# EasyEDA Pro project rf_connector_pcb.eprj

# Schematic Schematic1
Board Name: Board1; Create Date: 2024-05-29; Page Name: P1; Project Name: rf_connector_pcb; Schematic Name: Schematic1; Update Date: 2024-05-29; Company: EasyEDA.com; Drawn: EasyEDA; Page Size: A4; Part Number: JLCPCB-002; Reviewed: EasyEDA; Version: V0.1
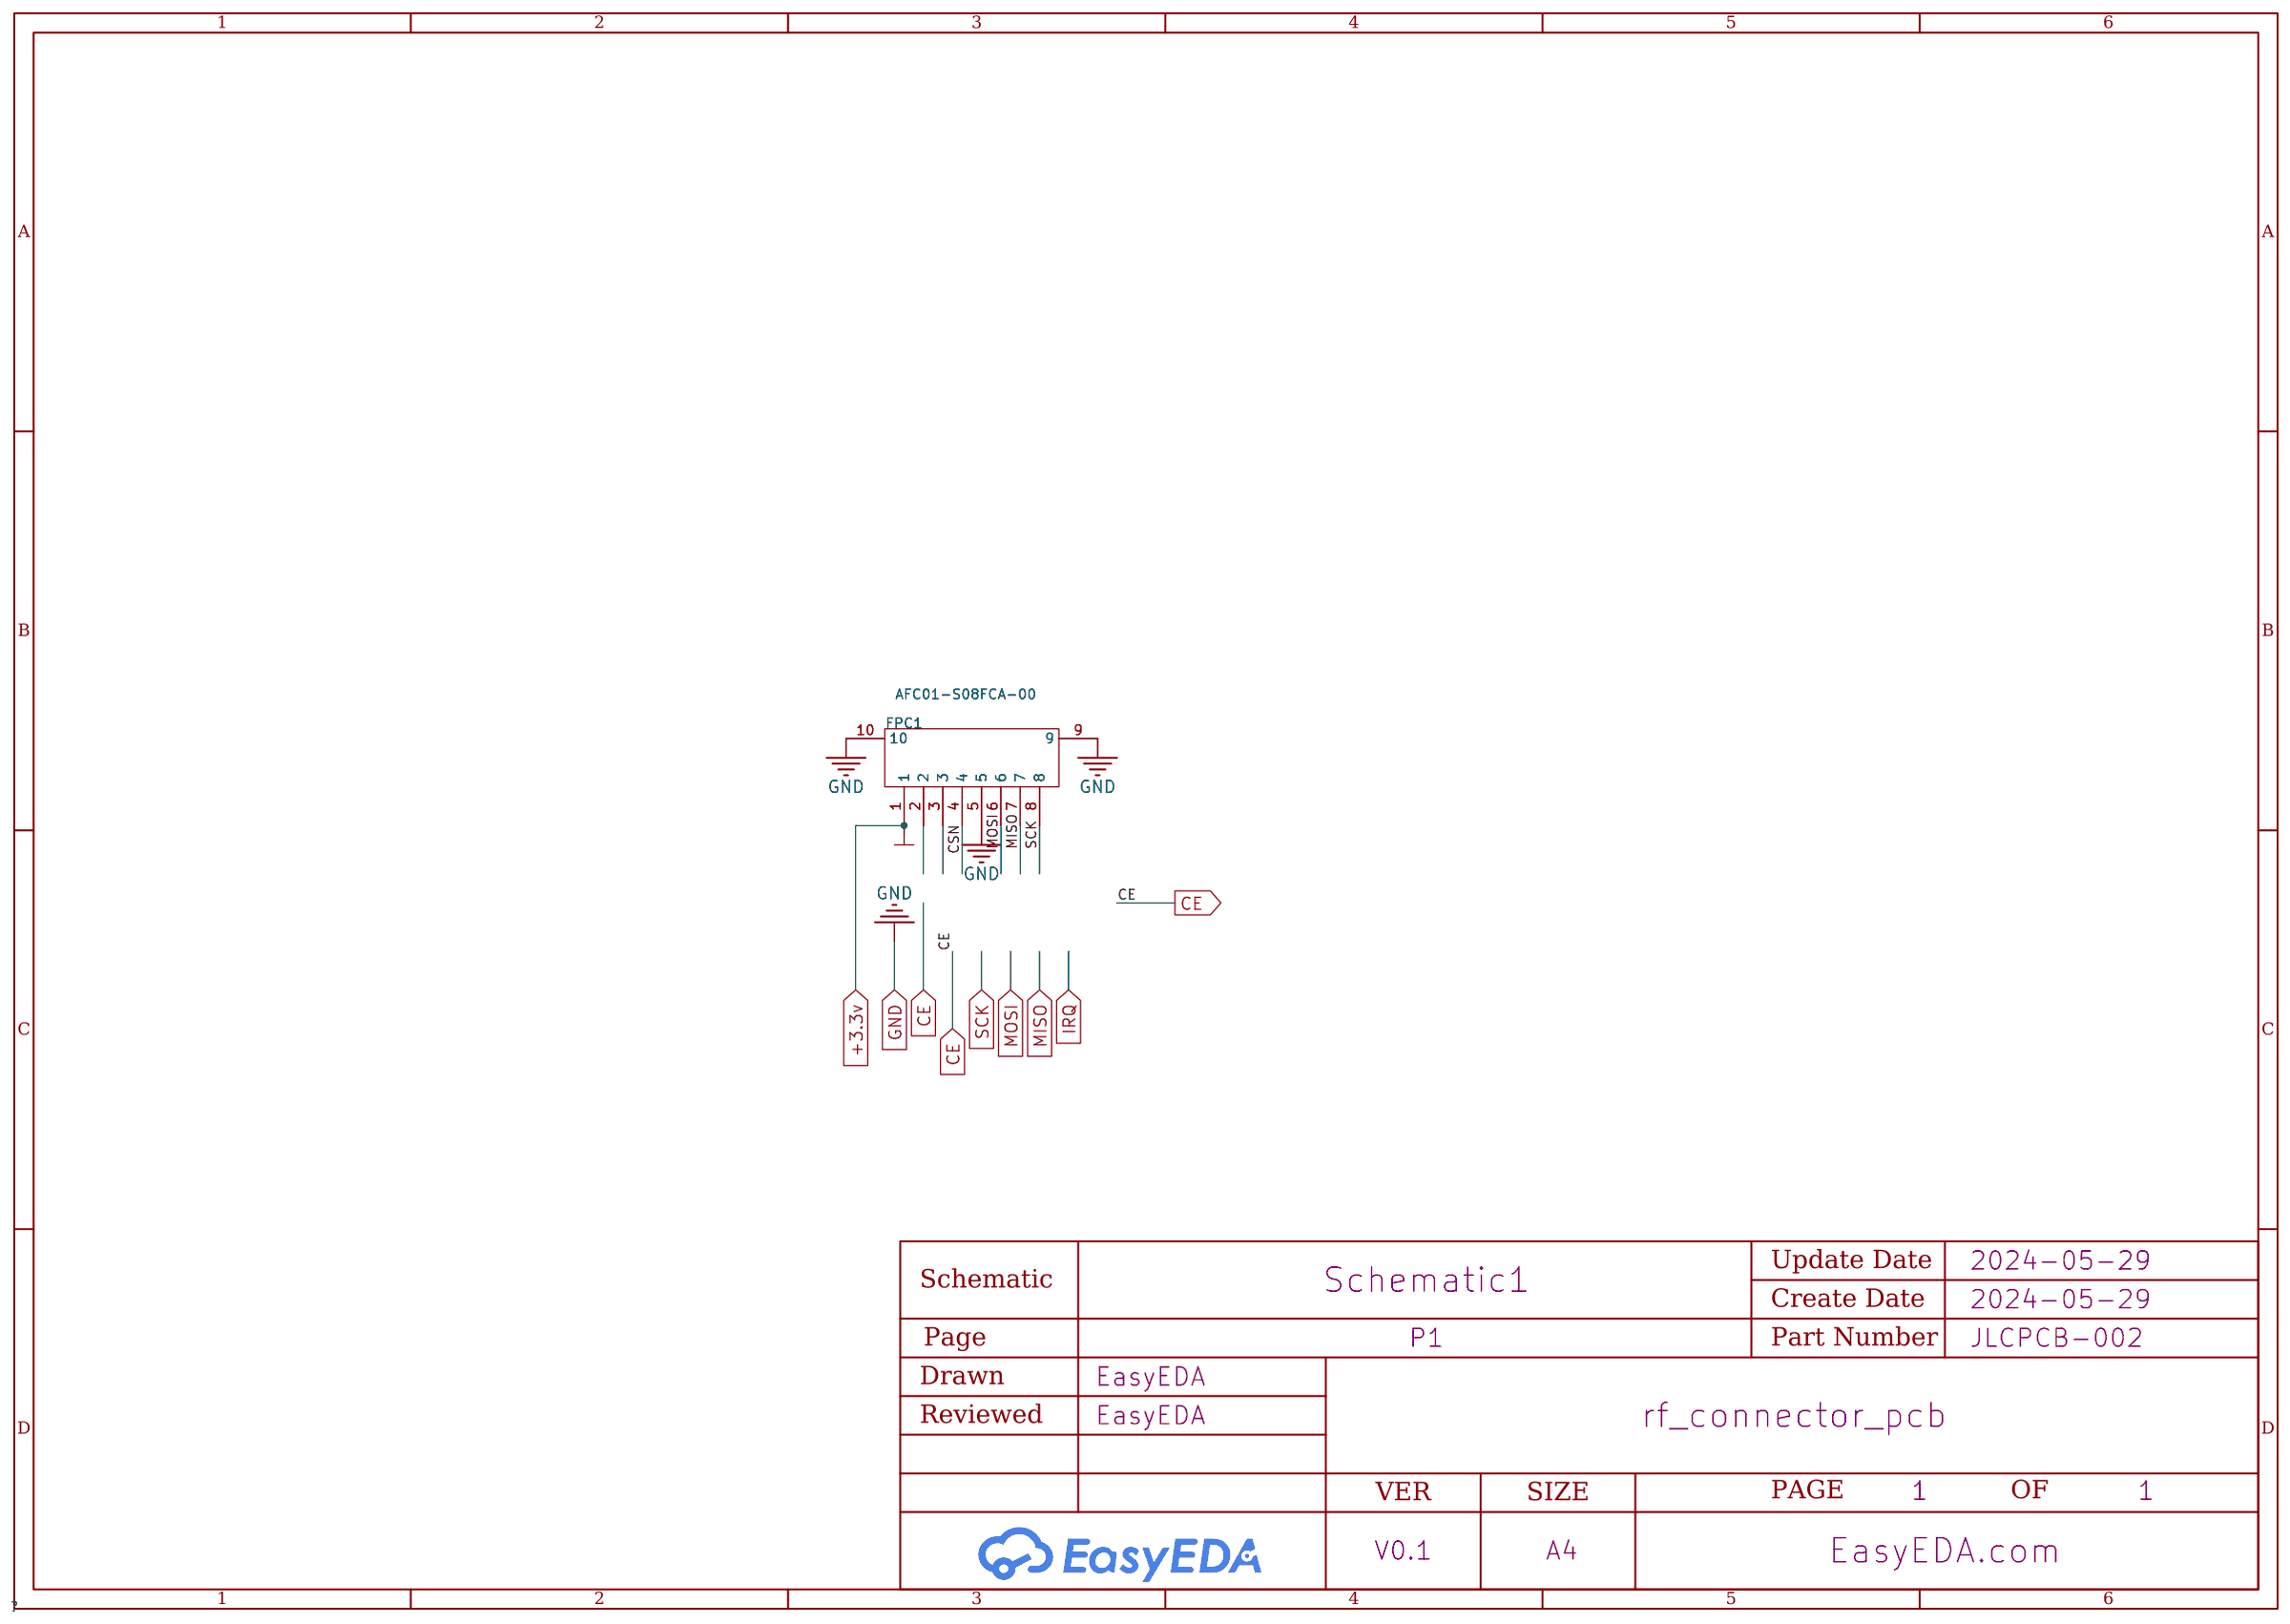
[diagram p0: schematic sheet]

## Parts
FPC1  AFC01-S08FCA-00  [FPC-SMD_P0.50-8P_FGS-XJ-H2.0]

## Library data of the parts
FPC1 = AFC01-S08FCA-00: 间距:0.5mm;触点数量:8P;锁定特性:翻盖式;触点类型:下接;安装类型:卧贴;; LCSC Part Name: 间距:0.5mm P数:8P 翻盖式 下接; Supplier Part: C262657; Manufacturer: JS(钜硕电子); Supplier Footprint: SMD,P=0.5mm; JLCPCB Part Class: 扩展库; Datasheet: https://atta.szlcsc.com/upload/public/pdf/source/20190816/C413942_2A72D1AC756EAE17EEDF756A339D4500.pdf; Supplier: LCSC; Pitch: 0.5mm; Number of Contacts: 8P; Locking Feature: 翻盖式; FFC, FCB Thickness: 0.3mm; Contact Type: 下接; Mounting Type: 卧贴; Height Above Board: 2mm

## Nets
+3.3v: FPC1.1
GND: FPC1.5 FPC1.9 FPC1.10
CSN: FPC1.4
MISO: FPC1.7
MOSI: FPC1.6
SCK: FPC1.8

Not connected (* = marked no-connect by the designer): FPC1 2 3

# Board PCB1
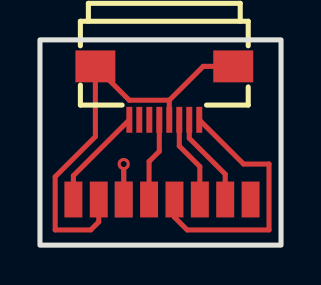
[diagram p1: board, top side]
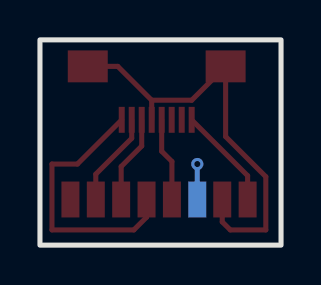
[diagram p2: board, bottom side, seen from below]

Outline 12.06 x 10.29 mm; copper layers: Top Layer, Bottom Layer. Coordinates in mm from the lower left corner of the outline.
Outline path: rectangle 0,10.29 12.06,0
Stack: Top Layer 0.035mm / Dielectric1 1.51mm FR4 er 4.5 / Bottom Layer 0.035mm

## Design rules (mm)
template: JLCPCB Capability(Two Layers Board)
spacing copperThickness1oz (default): track to track 0.102, other pairs 0.152 to 0.3
spacing copperThickness2oz: track to track 0.203, other pairs 0.152 to 0.3
track width copperThickness1oz (default): min 0.127, default 0.254, max 2.54
track width copperThickness2oz: min 0.203, default 0.254, max 2.54
differential pair differentialPair (default): width min 0.127, default 0.254, max 2.54; gap min 0.152, default 0.152
via viaSize (default): diameter min 0.5, default 0.61, max 10; hole min 0.3, default 0.305, max 6.3

## Placement (name value [footprint] x y rotation side)
FPC1  AFC01-S08FCA-00  [FPC-SMD_P0.50-8P_FGS-XJ-H2.0]  6.22 7.62 0 top
NOREF  -  [Pad_e74]  1.67 2.29 180 top
NOREF#2  -  [Pad_e73]  5.46 2.29 180 top
NOREF#3  -  [Pad_e72]  4.19 2.29 180 top
NOREF#4  -  [Pad_e83]  10.54 2.29 180 top
NOREF#5  -  [Pad_e860]  4.19 2.29 180 top
NOREF#6  -  [Pad_e75]  2.94 2.29 180 top
NOREF#7  -  [Pad_e82]  9.27 2.29 180 top
NOREF#8  -  [Pad_e79]  6.73 2.29 180 top
NOREF#9  -  [Pad_e80]  8 2.29 180 top

## Footprints (pads in the part's own frame, mm; a bottom-side part is the same pattern mirrored in y, then rotated)
FPC-SMD_P0.50-8P_FGS-XJ-H2.0
  rect 0.3x1.3 smd: 1(-1.75,-1.34) 2(-1.252,-1.339) 3(-0.75,-1.34) 4(-0.25,-1.34) 5(0.25,-1.34) 6(0.75,-1.34) 7(1.25,-1.34) 8(1.75,-1.34)
  rect 2x1.6 smd: 9(3.45,1.34) 10(-3.45,1.34)
Pad_e72
  rect 0.9x1.8 smd: 13(0,0)
Pad_e73
  rect 0.9x1.8 smd: 14(0,0)
Pad_e74
  rect 0.9x1.8 smd: 11(0,0)
Pad_e75
  rect 0.9x1.8 smd: 12(0,0)
Pad_e79
  rect 0.9x1.8 smd: 15(0,0)
Pad_e80
  rect 0.9x1.8 smd: 16(0,0)
Pad_e82
  rect 0.9x1.8 smd: 17(0,0)
Pad_e83
  rect 0.9x1.8 smd: 18(0,0)
Pad_e860
  rect 0.9x1.8 smd far side: 13(0,0)

## Nets
+3.3V: FPC1.1 NOREF.11
GND: FPC1.5 FPC1.9 FPC1.10 NOREF#6.12
CE: NOREF#3.13 NOREF#5.13
CSN: FPC1.4 NOREF#2.14
MISO: FPC1.7 NOREF#7.17
MOSI: FPC1.6 NOREF#9.16
SCK: FPC1.8 NOREF#8.15
$1N610: FPC1.3
$1N613: FPC1.2

Pads without a net: NOREF#4 18

## Via types
v1: diameter 0.61, hole 0.305, Top Layer to Bottom Layer, 1 via

## Routing (per net, layer and track width the routed paths; a pad name or vN(x,y) marks a point on that pad's centre or on a via; arc(x,y) is an arc through that point)
+3.3V: length 5.2
  Top Layer w0.254: NOREF.11 1.67,3.48 FPC1.1
GND: length 21.8
  Top Layer w0.254: FPC1.9 8.17,8.96 6.47,7.26 ; 6.47,7.26 4.47,7.26 FPC1.10 2.77,5.44 0.76,3.43 0.76,0.76 2.54,0.76 2.94,1.16 2.94,1.82 2.97,1.85 2.94,1.88 NOREF#6.12 ; 6.47,7.26 FPC1.5
CE: length 3.6
  Top Layer w0.254: v1(4.19,4.06) NOREF#3.13
  Bottom Layer w0.254: NOREF#3.13 v1(4.19,4.06)
CSN: length 4.2
  Top Layer w0.254: NOREF#2.14 5.46,4.19 5.97,4.7 FPC1.4
MISO: length 4.7
  Top Layer w0.254: FPC1.7 7.47,5.35 9.27,3.56 NOREF#7.17
MOSI: length 4.4
  Top Layer w0.254: FPC1.6 6.97,4.96 8,3.94 NOREF#9.16
SCK: length 13.6
  Top Layer w0.254: NOREF#8.15 6.73,1.4 7.37,0.76 11.46,0.76 11.46,4.06 10.19,4.06 FPC1.8
